# EAGLE design Main Circuit (EAGLE 9.4.2)
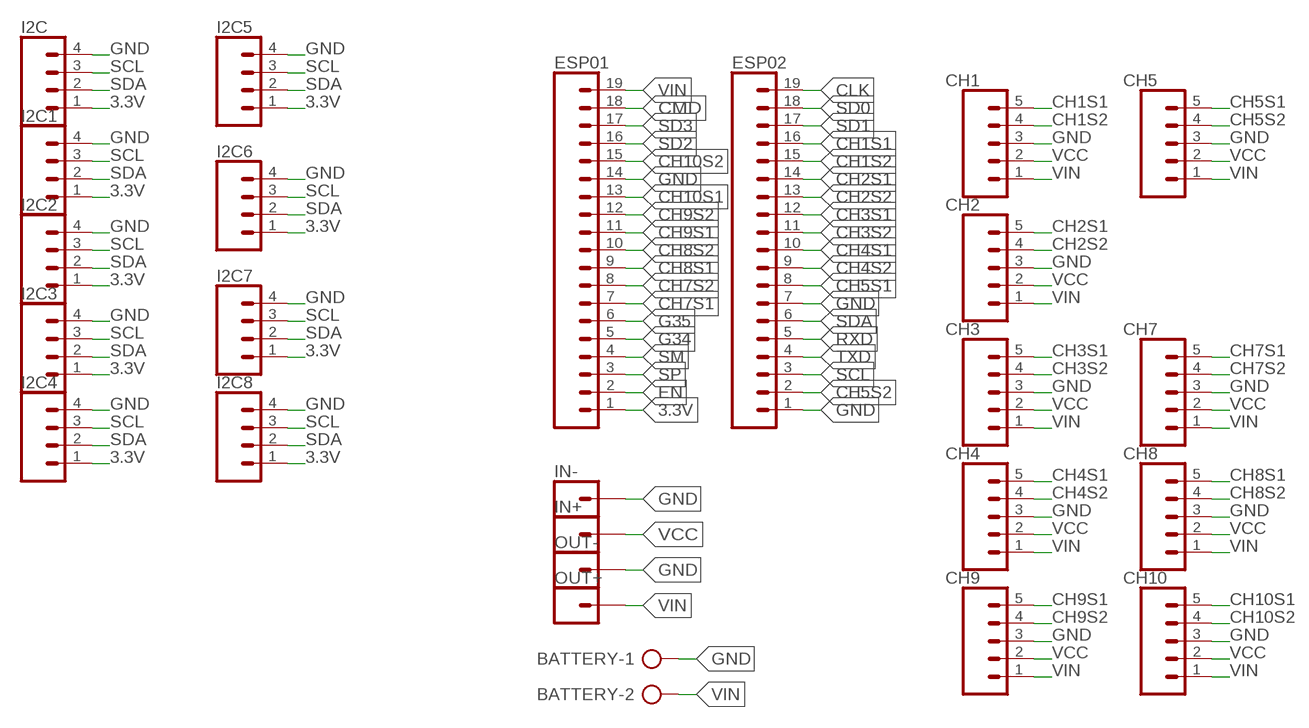
[diagram p0: schematic, sheet 1]

## Parts
BATTERY  AK500/2-H  [AK500/2-H]
CH1  CONN_05  [1X05]
CH2  CONN_05  [1X05]
CH3  CONN_05  [1X05]
CH4  CONN_05  [1X05]
CH5  CONN_05  [1X05]
CH7  CONN_05  [1X05]
CH8  CONN_05  [1X05]
CH9  CONN_05  [1X05]
CH10  CONN_05  [1X05]
ESP01  CONN_19  [1X19]
ESP02  CONN_19  [1X19]
I2C  CONN_04  [1X04]
I2C1  CONN_04  [1X04]
I2C2  CONN_04  [1X04]
I2C3  CONN_04  [1X04]
I2C4  CONN_04  [1X04]
I2C5  CONN_04  [1X04]
I2C6  CONN_04  [1X04]
I2C7  CONN_04  [1X04]
I2C8  CONN_04  [1X04]
IN+  CONN_01  [1X01]
IN-  CONN_01  [1X01]
OUT+  CONN_01  [1X01]
OUT-  CONN_01  [1X01]

## Nets
3.3V: ESP01.1 I2C1.1 I2C2.1 I2C3.1 I2C4.1 I2C5.1 I2C6.1 I2C7.1 I2C8.1 I2C.1
CH1S1: CH1.5 ESP02.16
CH1S2: CH1.4 ESP02.15
CH2S1: CH2.5 ESP02.14
CH2S2: CH2.4 ESP02.13
CH3S1: CH3.5 ESP02.12
CH3S2: CH3.4 ESP02.11
CH4S1: CH4.5 ESP02.10
CH4S2: CH4.4 ESP02.9
CH5S1: CH5.5 ESP02.8
CH5S2: CH5.4 ESP02.2
CH7S1: CH7.5 ESP01.7
CH7S2: CH7.4 ESP01.8
CH8S1: CH8.5 ESP01.9
CH8S2: CH8.4 ESP01.10
CH9S1: CH9.5 ESP01.11
CH9S2: CH9.4 ESP01.12
CH10S1: CH10.5 ESP01.13
CH10S2: CH10.4 ESP01.15
CLK: ESP02.19
CMD: ESP01.18
EN: ESP01.2
G34: ESP01.5
G35: ESP01.6
GND: BATTERY.1 CH1.3 CH2.3 CH3.3 CH4.3 CH5.3 CH7.3 CH8.3 CH9.3 CH10.3 ESP01.14 ESP02.1 ESP02.7 I2C1.4 I2C2.4 I2C3.4 I2C4.4 I2C5.4 I2C6.4 I2C7.4 I2C8.4 I2C.4 IN-.1 OUT-.1
RXD: ESP02.5
SCL: ESP02.3 I2C1.3 I2C2.3 I2C3.3 I2C4.3 I2C5.3 I2C6.3 I2C7.3 I2C8.3 I2C.3
SD0: ESP02.18
SD1: ESP02.17
SD2: ESP01.16
SD3: ESP01.17
SDA: ESP02.6 I2C1.2 I2C2.2 I2C3.2 I2C4.2 I2C5.2 I2C6.2 I2C7.2 I2C8.2 I2C.2
SM: ESP01.4
SP: ESP01.3
TXD: ESP02.4
VCC: CH1.2 CH2.2 CH3.2 CH4.2 CH5.2 CH7.2 CH8.2 CH9.2 CH10.2 IN+.1
VIN: BATTERY.2 CH1.1 CH2.1 CH3.1 CH4.1 CH5.1 CH7.1 CH8.1 CH9.1 CH10.1 ESP01.19 OUT+.1

## Library data of the parts
BATTERY = con-ptr500:AK500/2-H: CONNECTOR Aug. 2004 / PTR Meßtechnik: Die Bezeichnung der Serie AK505 wurde geändert. Es handelt sich hierbei um AK500 in horizontaler Ausführung.; OC_FARNELL: unknown; OC_NEWARK: unknown
CH1-CH5 CH7-CH10 = SparkFun-Connectors:CONN_05: Multi connection point. Often used as Generic Header-pin footprint for 0.1 inch spaced/style header connections On any of the 0.1 inch spaced packages, you can populate with these: Break Away Headers - Straight <https://www.sparkfun.com/products/116> (PRT-00116) Break Away Male Headers - Right Angle <https://www.sparkfun.com/products/553> (PRT-00553) Female Headers <https://www.sparkfun.com/products/115> (PRT-00115) Break Away Headers - Machine Pin <https://www.sparkfun.com/products/117> (PRT-00117) Break Away Female Headers - Swiss Machine Pin <https://www.sparkfun.com/products/743> (PRT-00743) For SCREWTERMINALS and SPRING TERMINALS visit here: Screw Terimnals on SparkFun.com <https://www.sparkfun.com/search/results?term=Screw+Terminals> (5mm/3.5mm/2.54mm spacing) This device is also useful as a general connection point to wire up your design to another part of your project. Our various solder wires solder well into these plated through hole pads. Hook-Up Wire - Assortment (Stranded, 22 AWG) <https://www.sparkfun.com/products/11375> (PRT-11375) Hook-Up Wire - Assortment (Solid Core, 22 AWG) <https://www.sparkfun.com/products/11367> (PRT-11367) View the entire wire category on our website here <https://www.sparkfun.com/categories/141> Special notes: Molex polarized connector foot print use with SKU : PRT-08231 with associated crimp pins and housings. 1MM SMD Version SKU: PRT-10208
ESP01 ESP02 = SparkFun-Connectors:CONN_19: Multi connection point. Often used as Generic Header-pin footprint for 0.1 inch spaced/style header connections On any of the 0.1 inch spaced packages, you can populate with these: Break Away Headers - Straight <https://www.sparkfun.com/products/116> (PRT-00116) Break Away Male Headers - Right Angle <https://www.sparkfun.com/products/553> (PRT-00553) Female Headers <https://www.sparkfun.com/products/115> (PRT-00115) Break Away Headers - Machine Pin <https://www.sparkfun.com/products/117> (PRT-00117) Break Away Female Headers - Swiss Machine Pin <https://www.sparkfun.com/products/743> (PRT-00743) For SCREWTERMINALS and SPRING TERMINALS visit here: Screw Terimnals on SparkFun.com <https://www.sparkfun.com/search/results?term=Screw+Terminals> (5mm/3.5mm/2.54mm spacing) This device is also useful as a general connection point to wire up your design to another part of your project. Our various solder wires solder well into these plated through hole pads. Hook-Up Wire - Assortment (Stranded, 22 AWG) <https://www.sparkfun.com/products/11375> (PRT-11375) Hook-Up Wire - Assortment (Solid Core, 22 AWG) <https://www.sparkfun.com/products/11367> (PRT-11367) View the entire wire category on our website here <https://www.sparkfun.com/categories/141> Special notes: Molex polarized connector foot print use with SKU : PRT-08231 with associated crimp pins and housings. 1MM SMD Version SKU: PRT-10208 NOTES ON THE VARIANTS LOCK and LOCK_LONGPADS... This footprint was designed to help hold the alignment of a through-hole component (i.e. 6-pin header) while soldering it into place. You may notice that each hole has been shifted either up or down by 0.005 of an inch from it's more standard position (which is a perfectly straight line). This slight alteration caused the pins (the squares in the middle) to touch the edges of the holes. Because they are alternating, it causes a "brace" to hold the component in place. 0.005 has proven to be the perfect amount of "off-center" position when using our standard breakaway headers. Although looks a little odd when you look at the bare footprint, once you have a header in there, the alteration is very hard to notice. Also,if you push a header all the way into place, it is covered up entirely on the bottom side.
I2C I2C1-I2C8 = SparkFun-Connectors:CONN_04: Multi connection point. Often used as Generic Header-pin footprint for 0.1 inch spaced/style header connections On any of the 0.1 inch spaced packages, you can populate with these: Break Away Headers - Straight <https://www.sparkfun.com/products/116> (PRT-00116) Break Away Male Headers - Right Angle <https://www.sparkfun.com/products/553> (PRT-00553) Female Headers <https://www.sparkfun.com/products/115> (PRT-00115) Break Away Headers - Machine Pin <https://www.sparkfun.com/products/117> (PRT-00117) Break Away Female Headers - Swiss Machine Pin <https://www.sparkfun.com/products/743> (PRT-00743) For SCREWTERMINALS and SPRING TERMINALS visit here: Screw Terimnals on SparkFun.com <https://www.sparkfun.com/search/results?term=Screw+Terminals> (5mm/3.5mm/2.54mm spacing) This device is also useful as a general connection point to wire up your design to another part of your project. Our various solder wires solder well into these plated through hole pads. Hook-Up Wire - Assortment (Stranded, 22 AWG) <https://www.sparkfun.com/products/11375> (PRT-11375) Hook-Up Wire - Assortment (Solid Core, 22 AWG) <https://www.sparkfun.com/products/11367> (PRT-11367) View the entire wire category on our website here <https://www.sparkfun.com/categories/141> Special notes: Molex polarized connector foot print use with SKU : PRT-08231 with associated crimp pins and housings. 1MM SMD Version SKU: PRT-10208; PROD_ID: CONN-09696
IN+ IN- OUT+ OUT- = SparkFun-Connectors:CONN_01: Single connection point. Often used as Generic Header-pin footprint for 0.1 inch spaced/style header connections On any of the 0.1 inch spaced packages, you can populate with these: Break Away Headers - Straight <https://www.sparkfun.com/products/116> (PRT-00116) Break Away Male Headers - Right Angle <https://www.sparkfun.com/products/553> (PRT-00553) Female Headers <https://www.sparkfun.com/products/115> (PRT-00115) Break Away Headers - Machine Pin <https://www.sparkfun.com/products/117> (PRT-00117) Break Away Female Headers - Swiss Machine Pin <https://www.sparkfun.com/products/743> (PRT-00743) This device is also useful as a general connection point to wire up your design to another part of your project. Our various solder wires solder well into these plated through hole pads. Hook-Up Wire - Assortment (Stranded, 22 AWG) <https://www.sparkfun.com/products/11375> (PRT-11375) Hook-Up Wire - Assortment (Solid Core, 22 AWG) <https://www.sparkfun.com/products/11367> (PRT-11367) View the entire wire category on our website here <https://www.sparkfun.com/categories/141> Special notes: SMTSO-256-ET is a "flush mount" nut for a 4-40 screw. We mostly use this on specialty testbeds; it is a nice way to connect hardware to your PCB at an adjustable hieght. Also note, the SNAP packages are for using a snappable style connector. We sell a baggie of snaps and they are also used on two LilyPad designs: Snap Assortment - 30 pack (male and female) <https://www.sparkfun.com/products/11347> (DEV-11347) LilyPad Arduino SimpleSnap <https://www.sparkfun.com/products/10941> (DEV-10941) LilyPad SimpleSnap Protoboard <https://www.sparkfun.com/products/10940> (DEV-10940)

## Board
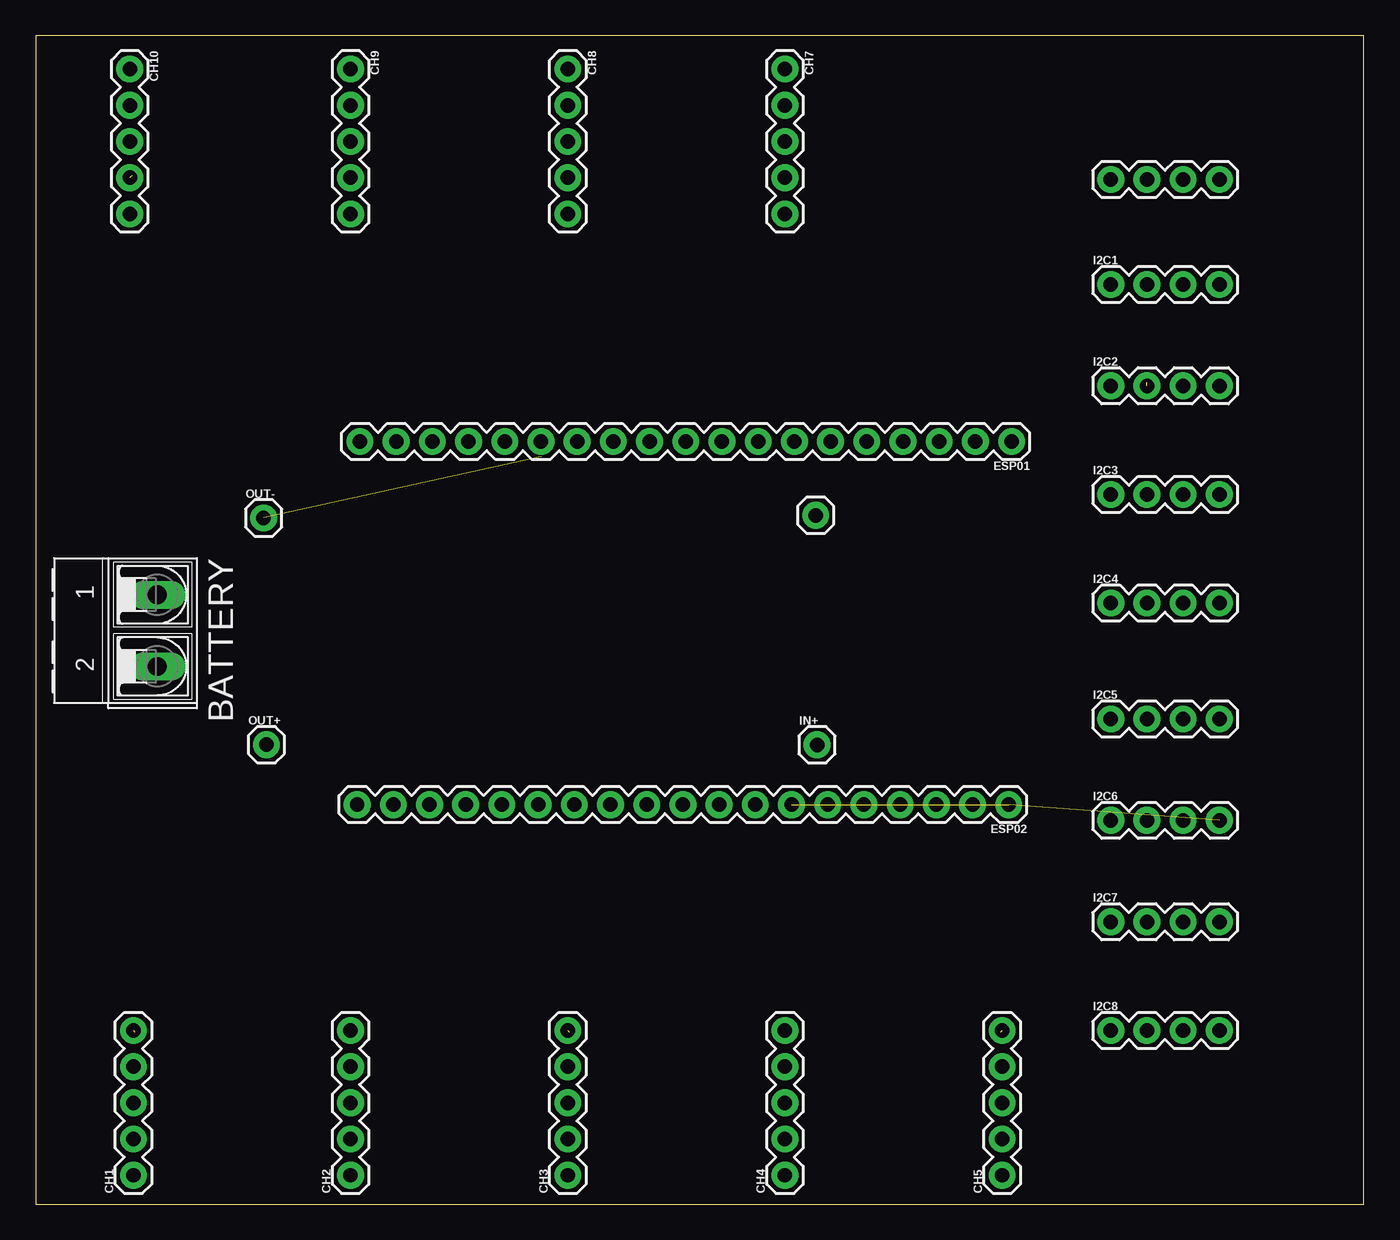
[diagram p1: board, top side]
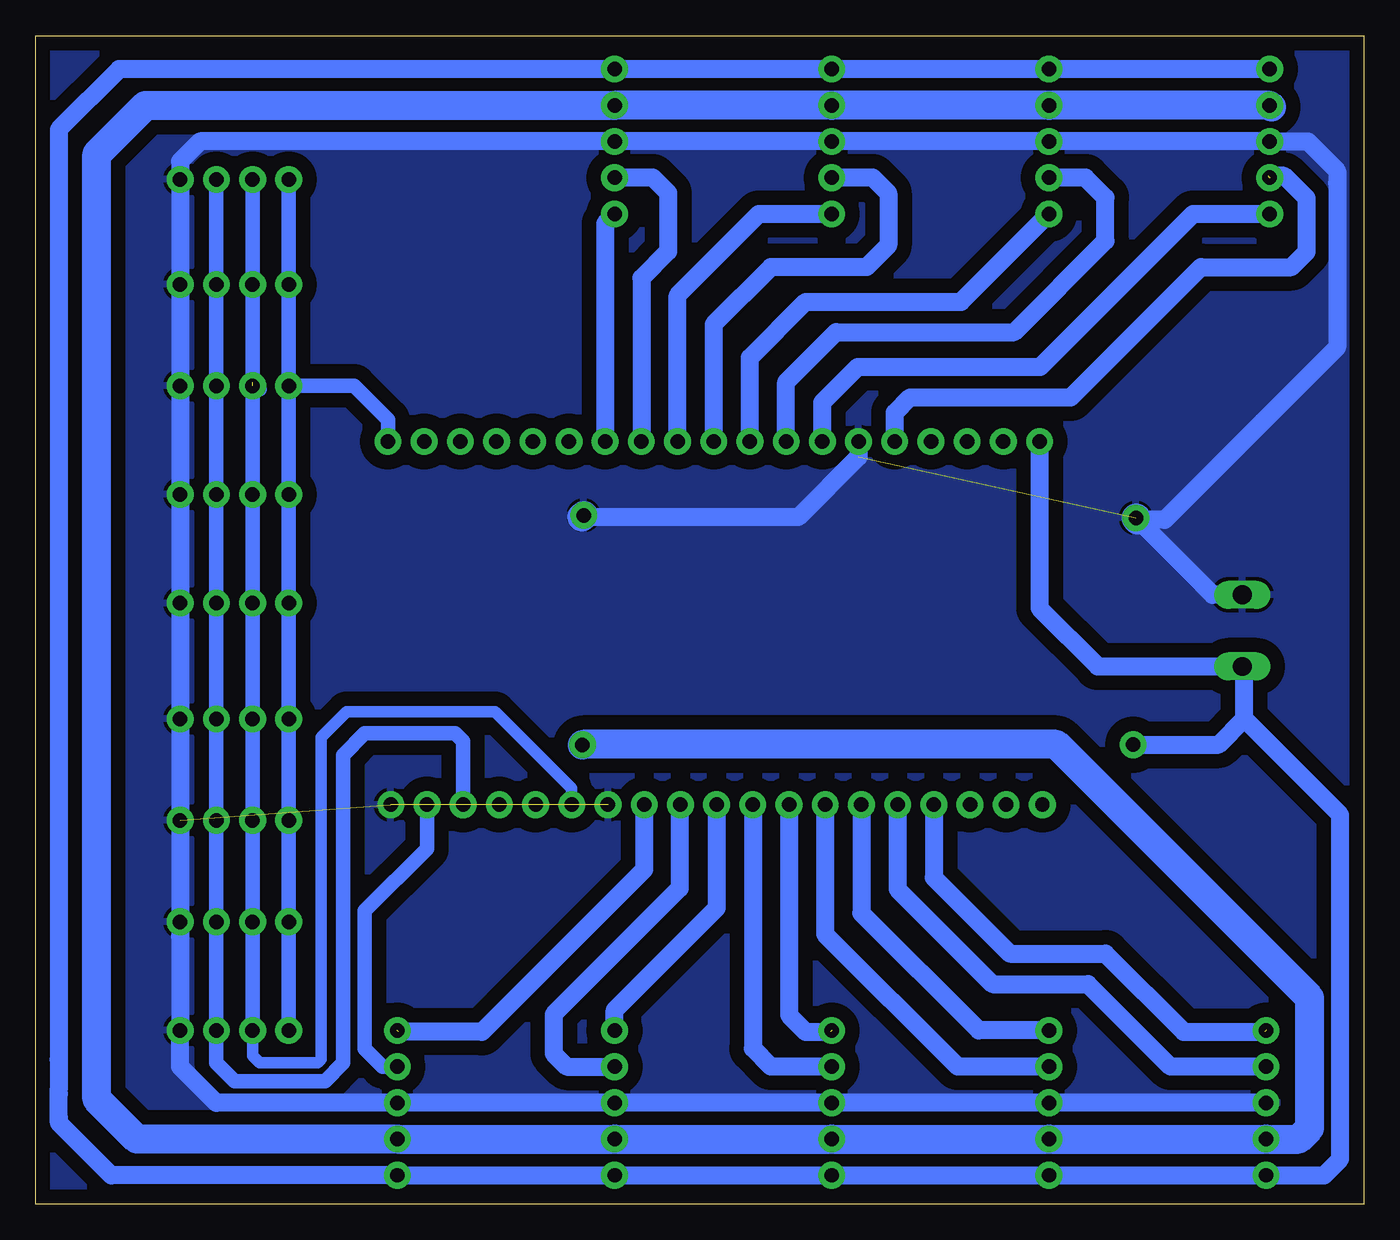
[diagram p2: board, bottom side, seen from below]

Size 93.2 x 81.97 mm. Coordinates in mm from the lower left corner, seen from the top.
Outline: 0,0 93.2,0 93.2,81.97 0,81.97 0,0
Copper layers (1*16): Top 0.035mm / dielectric 1.5mm / Bottom 0.035mm
Design rules "default": minimum track width 6mil, minimum drill 0.35mm, track to track 6mil, track to pad 6mil, pad to pad 6mil, via to via 6mil, smd to smd 6mil, copper to edge 40mil, drill to drill 6mil, minimum pad ring 10mil, minimum via ring 8mil, stop-mask expansion 4mil, vias tented up to drill 0mil, thermal gap 10mil

### Footprints (pad centres in the part's own frame; a part is rotated, then mirrored left to right if it is on the bottom)
AK500/2-H = drill 1.321 long: 1 -2.515,0; 2 2.515,0
1X05 = drill 1.016 pad 1.88: 1 0,0; 2 2.54,0; 3 5.08,0; 4 7.62,0; 5 10.16,0
1X19 = drill 1.016 pad 1.88: 1 0,0; 2 2.54,0; 3 5.08,0; 4 7.62,0; 5 10.16,0; 6 12.7,0; 7 15.24,0; 8 17.78,0; 9 20.32,0; 10 22.86,0; 11 25.4,0; 12 27.94,0; 13 30.48,0; 14 33.02,0; 15 35.56,0; 16 38.1,0; 17 40.64,0; 18 43.18,0; 19 45.72,0
1X04 = drill 1.016 pad 1.88: 1 0,0; 2 2.54,0; 3 5.08,0; 4 7.62,0
1X01 = drill 1.016 pad 1.88: 1 0,0

### Placement (x,y rotation side)
BATTERY  8.53,40.23 270 top
CH1  6.86,2.03 90 top
CH2  22.1,2.03 90 top
CH3  37.34,2.03 90 top
CH4  52.58,2.03 90 top
CH5  67.82,2.03 90 top
CH7  52.58,79.62 270 top
CH8  37.34,79.62 270 top
CH9  22.1,79.62 270 top
CH10  6.6,79.62 270 top
ESP01  68.48,53.49 180 top
ESP02  68.28,28.03 180 top
I2C  75.44,71.88 0 top
I2C1  75.44,64.52 0 top
I2C2  75.44,57.4 0 top
I2C3  75.44,49.78 0 top
I2C4  75.44,42.16 0 top
I2C5  75.44,34.04 0 top
I2C6  75.44,26.92 0 top
I2C7  75.44,19.81 0 top
I2C8  75.44,12.19 0 top
IN+  54.83,32.22 0 top
IN-  54.74,48.32 0 top
OUT+  16.19,32.23 0 top
OUT-  16,48.13 0 top

### Tracks (layer width: path | path; a pad name or v marks a point on that pad's centre or on a via)
3.3V
  Bottom 1.016: ESP01.1 68.48,55.02 70.87,57.4 I2C2.1 | I2C.1 I2C1.1 I2C2.1 | I2C2.1 I2C3.1 I2C4.1 I2C5.1 I2C6.1 I2C7.1 I2C8.1
CH1S1  (1 unrouted)
  Bottom 1.27: ESP02.16 30.18,22.91 24.84,17.58 18.14,17.58 12.65,12.09 6.96,12.09
CH1S2
  Bottom 1.27: ESP02.15 32.72,22.1 26.06,15.44 19.36,15.44 13.56,9.65 CH1.4
CH2S1
  Bottom 1.27: ESP02.14 35.26,20.42 27.03,12.19 CH2.5
CH2S2
  Bottom 1.27: ESP02.13 37.8,18.95 28.5,9.65 CH2.4
CH3S1  (1 unrouted)
  Bottom 1.27: ESP02.12 40.34,13.26 39.17,12.09 37.44,12.09
CH3S2
  Bottom 1.27: ESP02.11 42.88,10.93 41.6,9.65 CH3.4
CH4S1
  Bottom 1.27: ESP02.10 45.42,20.77 52.58,13.61 CH4.5
CH4S2
  Bottom 1.27: ESP02.9 48.01,27.98 48.01,22.15 56.84,13.31 56.84,10.57 55.93,9.65 CH4.4
CH5S1  (1 unrouted)
  Bottom 1.27: ESP02.8 50.5,23.47 61.87,12.09 67.72,12.09
CH5S2
  Bottom 1.016: CH5.4 68.83,9.65 70.1,10.92 70.1,20.57 65.74,24.94 ESP02.2
CH7S1
  Bottom 1.27: ESP01.7 53.24,68.8 CH7.5
CH7S2
  Bottom 1.27: ESP01.8 50.7,64.95 48.82,66.83 48.82,70.93 49.89,72 CH7.4
CH8S1
  Bottom 1.27: ESP01.9 48.16,63.75 42.45,69.46 CH8.5
CH8S2
  Bottom 1.27: ESP01.10 45.62,61.72 41.6,65.73 34.9,65.73 33.38,67.26 33.38,70.92 34.46,72 CH8.4
CH9S1
  Bottom 1.27: ESP01.11 43.08,59.39 39.17,63.3 28.26,63.3 CH9.5
CH9S2
  Bottom 1.27: ESP01.12 40.54,57.66 37.03,61.16 24.54,61.16 18.14,67.56 18.14,70.61 19.53,72 CH9.4
CH10S1
  Bottom 1.27: ESP01.13 38,56.24 35.51,58.73 22.71,58.73 11.97,69.46 CH10.5
CH10S2  (1 unrouted)
  Bottom 1.27: ESP01.15 32.92,55.52 31.85,56.59 20.57,56.59 11.43,65.73 5.08,65.73 4.01,66.8 4.01,70.56 5.59,72.14 6.72,72.14
GND  (3 unrouted)
  Bottom 1.016: I2C6.4 I2C7.4 83.06,18.8 I2C8.4
  Bottom 1.27: CH1.3 CH2.3 CH3.3 CH4.3 CH5.3 80.52,7.11 83.06,9.65 I2C8.4 I2C7.4 | 83.06,18.8 I2C6.4 I2C5.4 I2C4.4 I2C3.4 I2C2.4 I2C1.4 I2C.4 83.06,73.15 81.67,74.54 CH7.3 CH8.3 CH9.3 CH10.3 3.93,74.54 1.88,72.49 1.87,71.62 1.87,60.1 7.06,54.91 | 7.06,54.91 7.11,54.91 | 7.06,54.91 13.97,48.01 15.87,48.01 10.61,42.75 BATTERY.1 | ESP01.14 35.46,52.43 39.69,48.2 54.86,48.2
  Bottom 2.032: 15.87,48.01 OUT-.1 | 54.86,48.2 IN-.1
  pour Bottom (isolate 1.016): 0,82.04 92.96,82.04 92.96,0 0,0
SCL
  Bottom 1.016: ESP02.3 63.2,32.46 63.75,33.02 70.1,33.02 71.63,31.5 71.63,9.91 72.9,8.64 79.25,8.64 80.52,9.91 I2C8.3 I2C7.3 I2C6.3 I2C5.3 I2C4.3 I2C3.3 I2C2.3 I2C1.3 I2C.3
SDA  (1 unrouted)
  Bottom 0.813: ESP02.6 55.58,29.16 60.96,34.54 71.37,34.54 73.15,32.77 73.15,10.16 73.41,9.91 77.47,9.91 77.98,10.41 I2C8.2
  Bottom 1.016: I2C.2 I2C1.2 77.98,57.66 77.47,57.15 | 77.72,57.15 I2C2.2 I2C3.2 I2C4.2 I2C5.2 I2C6.2 I2C7.2 I2C8.2
VCC
  Bottom 2.032: 6.48,76.96 CH10.2 CH9.2 CH8.2 CH7.2 85.48,77.08 88.9,73.66 88.9,7.37 86.11,4.57 CH5.2 CH4.2 CH3.2 CH2.2 CH1.2 4.57,4.57 3.81,5.33 3.81,14.48 21.59,32.26 54.79,32.26 IN+.1
VIN
  Bottom 1.27: CH10.1 CH9.1 CH8.1 CH7.1 87.34,79.62 91.57,75.39 91.57,10.16 | OUT+.1 10.18,32.23 8.38,34.04 | 8.38,34.04 8.38,37.57 BATTERY.2 18.67,37.72 22.76,41.81 ESP01.19 | 8.38,34.04 1.66,27.32 1.66,3.17 2.79,2.03 CH1.1 CH2.1 CH3.1 CH4.1 CH5.1 87.88,2.03 91.56,5.71 91.57,6.1 91.57,7.75 91.57,8.13 91.57,10.16 | 91.57,10.16 91.58,10.16